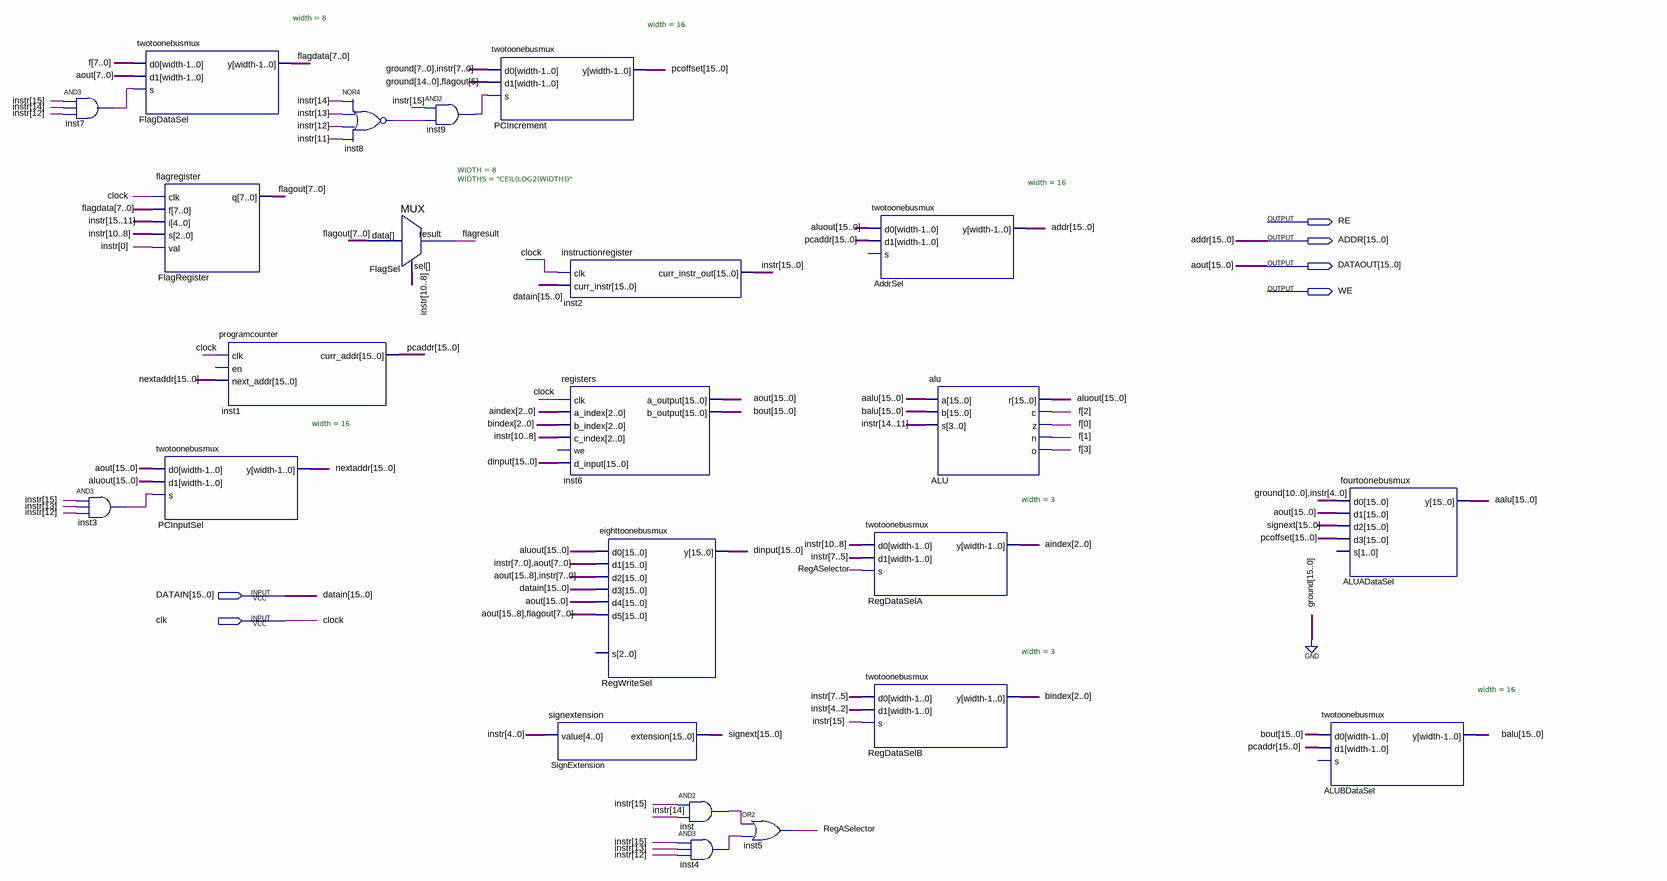
[diagram p0: schematic sheet]
// Quartus schematic cpu.bdf as structural Verilog: 23 symbols, 6 pins
module cpu (
  input  [15:0] DATAIN,
  input  clk,
  output RE,
  output [15:0] ADDR,
  output [15:0] DATAOUT,
  output WE
);

  wire flagresult, inst3_out, inst4_out, inst7_out, inst8_out, inst9_out, inst_out, RegASelector;
  wire [2:0] aindex, bindex;
  wire [7:0] f, flagdata, flagout;
  wire [15:0] aalu, aluout, balu, bout, dinput, instr, nextaddr, pcaddr, pcoffset, signext;

  and inst7 (inst7_out, instr[15], instr[14], instr[12]);
  and inst3 (inst3_out, instr[15], instr[13], instr[12]);
  twotoonebusmux #(.width(8)) FlagDataSel (.d0(f), .d1(DATAOUT[7:0]), .s(inst7_out), .y(flagdata));
  flagregister FlagRegister (.clk(clk), .f(flagdata), .i(instr[15:11]), .s(instr[10:8]), .val(instr[0]), .q(flagout));
  twotoonebusmux #(.width(16)) PCInputSel (.d0(DATAOUT), .d1(aluout), .s(inst3_out), .y(nextaddr));
  programcounter inst1 (.clk(clk), .next_addr(nextaddr), .curr_addr(pcaddr));  // open: en
  nor inst8 (inst8_out, instr[14], instr[13], instr[12], instr[11]);
  MUX #(.WIDTH(8), .WIDTHS("CEIL(LOG2(WIDTH))")) FlagSel (.data(flagout), .sel(instr[10:8]), .result(flagresult));
  and inst9 (inst9_out, instr[15], inst8_out);
  twotoonebusmux #(.width(16)) PCIncrement (
    .d0({{8{1'b0}}, instr[7:0]}), .d1({{15{1'b0}}, flagout[5]}), .s(inst9_out), .y(pcoffset));
  instructionregister inst2 (.clk(clk), .curr_instr(DATAIN), .curr_instr_out(instr));
  registers inst6 (
    .clk(clk), .a_index(aindex), .b_index(bindex), .c_index(instr[10:8]), .d_input(dinput),
    .a_output(DATAOUT), .b_output(bout));  // open: we
  signextension SignExtension (.value(instr[4:0]), .extension(signext));
  eighttoonebusmux RegWriteSel (
    .d0(aluout), .d1({instr[7:0], DATAOUT[7:0]}), .d2({DATAOUT[15:8], instr[7:0]}), .d3(DATAIN),
    .d4(DATAOUT), .d5({DATAOUT[15:8], flagout}), .y(dinput));  // open: s
  and inst (inst_out, instr[15], instr[14]);
  and inst4 (inst4_out, instr[15], instr[13], instr[12]);
  or inst5 (RegASelector, inst_out, inst4_out);
  twotoonebusmux #(.width(16)) AddrSel (.d0(aluout), .d1(pcaddr), .y(ADDR));  // open: s
  twotoonebusmux #(.width(3)) RegDataSelA (.d0(instr[10:8]), .d1(instr[7:5]), .s(RegASelector), .y(aindex));
  twotoonebusmux #(.width(3)) RegDataSelB (.d0(instr[7:5]), .d1(instr[4:2]), .s(instr[15]), .y(bindex));
  alu ALU (.a(aalu), .b(balu), .s(instr[14:11]), .r(aluout), .c(f[2]), .z(f[0]), .n(f[1]), .o(f[3]));
  fourtoonebusmux ALUADataSel (
    .d0({{11{1'b0}}, instr[4:0]}), .d1(DATAOUT), .d2(signext), .d3(pcoffset), .y(aalu));  // open: s
  twotoonebusmux #(.width(16)) ALUBDataSel (.d0(bout), .d1(pcaddr), .y(balu));  // open: s

  // Other names for the same wires on the sheet: aout[15:0] = DATAOUT; clock = clk
endmodule
